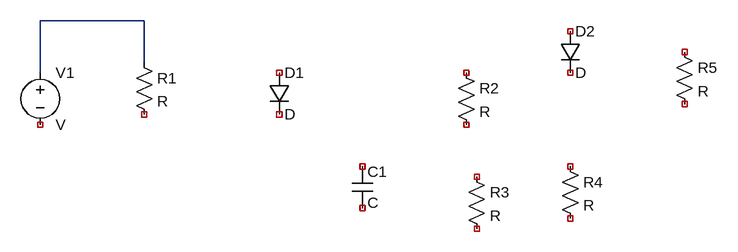
[diagram p0: schematic Draft2.asc]
Draft2.asc, the LTspice schematic file:
Version 4.1
SHEET 1 920 680
WIRE 32 -32 -128 -32
WIRE 32 32 32 -32
WIRE -128 48 -128 -32
SYMBOL voltage -128 32 R0
SYMATTR InstName V1
SYMBOL res 16 16 R0
SYMATTR InstName R1
SYMBOL diode 224 48 R0
SYMATTR InstName D1
SYMBOL cap 352 192 R0
SYMATTR InstName C1
SYMBOL res 512 32 R0
SYMATTR InstName R2
SYMBOL res 528 192 R0
SYMATTR InstName R3
SYMBOL diode 672 -16 R0
SYMATTR InstName D2
SYMBOL res 672 176 R0
SYMATTR InstName R4
SYMBOL res 848 0 R0
SYMATTR InstName R5

The netlist it stands for:
* Draft2.asc
V1 N001 NC_01 V
R1 N001 NC_02 R
D1 NC_03 NC_04 D
C1 NC_05 NC_06 C
R2 NC_07 NC_08 R
R3 NC_09 NC_10 R
D2 NC_11 NC_12 D
R4 NC_13 NC_14 R
R5 NC_15 NC_16 R
.model D D
.lib standard.dio
.backanno
.end